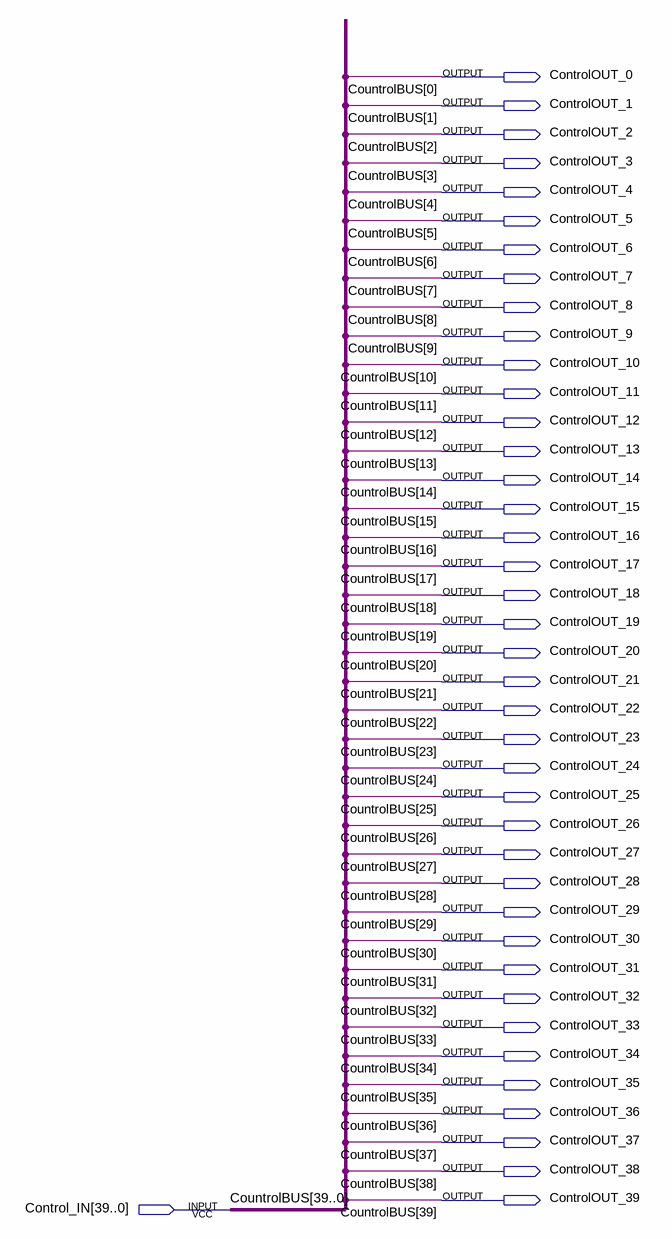
[diagram p0: schematic sheet]
// Quartus schematic Bus2Control.bdf as structural Verilog: 0 symbols, 41 pins
module Bus2Control (
  input  [39:0] Control_IN,
  output ControlOUT_0,
  output ControlOUT_1,
  output ControlOUT_2,
  output ControlOUT_3,
  output ControlOUT_4,
  output ControlOUT_5,
  output ControlOUT_6,
  output ControlOUT_7,
  output ControlOUT_8,
  output ControlOUT_9,
  output ControlOUT_10,
  output ControlOUT_11,
  output ControlOUT_12,
  output ControlOUT_13,
  output ControlOUT_14,
  output ControlOUT_15,
  output ControlOUT_16,
  output ControlOUT_17,
  output ControlOUT_18,
  output ControlOUT_19,
  output ControlOUT_20,
  output ControlOUT_21,
  output ControlOUT_22,
  output ControlOUT_23,
  output ControlOUT_24,
  output ControlOUT_25,
  output ControlOUT_26,
  output ControlOUT_27,
  output ControlOUT_28,
  output ControlOUT_29,
  output ControlOUT_30,
  output ControlOUT_31,
  output ControlOUT_32,
  output ControlOUT_33,
  output ControlOUT_34,
  output ControlOUT_35,
  output ControlOUT_36,
  output ControlOUT_37,
  output ControlOUT_38,
  output ControlOUT_39
);


  assign ControlOUT_0 = Control_IN[0];
  assign ControlOUT_1 = Control_IN[1];
  assign ControlOUT_2 = Control_IN[2];
  assign ControlOUT_3 = Control_IN[3];
  assign ControlOUT_4 = Control_IN[4];
  assign ControlOUT_5 = Control_IN[5];
  assign ControlOUT_6 = Control_IN[6];
  assign ControlOUT_7 = Control_IN[7];
  assign ControlOUT_8 = Control_IN[8];
  assign ControlOUT_9 = Control_IN[9];
  assign ControlOUT_10 = Control_IN[10];
  assign ControlOUT_11 = Control_IN[11];
  assign ControlOUT_12 = Control_IN[12];
  assign ControlOUT_13 = Control_IN[13];
  assign ControlOUT_14 = Control_IN[14];
  assign ControlOUT_15 = Control_IN[15];
  assign ControlOUT_16 = Control_IN[16];
  assign ControlOUT_17 = Control_IN[17];
  assign ControlOUT_18 = Control_IN[18];
  assign ControlOUT_19 = Control_IN[19];
  assign ControlOUT_20 = Control_IN[20];
  assign ControlOUT_21 = Control_IN[21];
  assign ControlOUT_22 = Control_IN[22];
  assign ControlOUT_23 = Control_IN[23];
  assign ControlOUT_24 = Control_IN[24];
  assign ControlOUT_25 = Control_IN[25];
  assign ControlOUT_26 = Control_IN[26];
  assign ControlOUT_27 = Control_IN[27];
  assign ControlOUT_28 = Control_IN[28];
  assign ControlOUT_29 = Control_IN[29];
  assign ControlOUT_30 = Control_IN[30];
  assign ControlOUT_31 = Control_IN[31];
  assign ControlOUT_32 = Control_IN[32];
  assign ControlOUT_33 = Control_IN[33];
  assign ControlOUT_34 = Control_IN[34];
  assign ControlOUT_35 = Control_IN[35];
  assign ControlOUT_36 = Control_IN[36];
  assign ControlOUT_37 = Control_IN[37];
  assign ControlOUT_38 = Control_IN[38];
  assign ControlOUT_39 = Control_IN[39];

  // Other names for the same wires on the sheet: CountrolBUS[39:0] = Control_IN
endmodule
